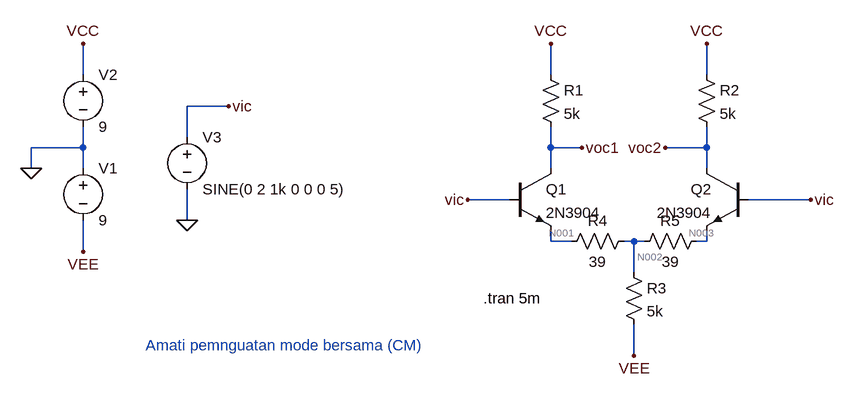
[diagram p0: schematic Perc-01-03-commonmode.asc]
Perc-01-03-commonmode.asc, the LTspice schematic file:
Version 4
SHEET 1 880 680
WIRE -320 -32 -320 -80
WIRE 400 -32 400 -80
WIRE 640 -32 640 -80
WIRE -96 16 -160 16
WIRE -160 64 -160 16
WIRE -320 80 -320 48
WIRE -320 80 -400 80
WIRE 400 80 400 48
WIRE 448 80 400 80
WIRE 640 80 640 48
WIRE 640 80 576 80
WIRE -400 112 -400 80
WIRE -320 112 -320 80
WIRE 400 112 400 80
WIRE 640 112 640 80
WIRE 336 160 272 160
WIRE 800 160 704 160
WIRE -160 192 -160 144
WIRE 400 224 400 208
WIRE 432 224 400 224
WIRE 528 224 512 224
WIRE 544 224 528 224
WIRE 640 224 640 208
WIRE 640 224 624 224
WIRE -320 240 -320 192
WIRE 528 272 528 224
WIRE 528 400 528 352
FLAG 400 -80 VCC
FLAG 640 -80 VCC
FLAG 528 400 VEE
FLAG 448 80 voc1
FLAG 576 80 voc2
FLAG -320 -80 VCC
FLAG -320 240 VEE
FLAG -400 112 0
FLAG -160 192 0
FLAG -96 16 vic
FLAG 272 160 vic
FLAG 800 160 vic
SYMBOL npn 336 112 R0
SYMATTR InstName Q1
SYMATTR Value 2N3904
SYMBOL npn 704 112 M0
SYMATTR InstName Q2
SYMATTR Value 2N3904
SYMBOL res 384 -48 R0
SYMATTR InstName R1
SYMATTR Value 5k
SYMBOL res 624 -48 R0
SYMATTR InstName R2
SYMATTR Value 5k
SYMBOL res 512 256 R0
SYMATTR InstName R3
SYMATTR Value 5k
SYMBOL voltage -320 96 R0
WINDOW 123 0 0 Left 0
WINDOW 39 0 0 Left 0
SYMATTR InstName V1
SYMATTR Value 9
SYMBOL voltage -320 -48 R0
WINDOW 123 0 0 Left 0
WINDOW 39 0 0 Left 0
SYMATTR InstName V2
SYMATTR Value 9
SYMBOL voltage -160 48 R0
WINDOW 123 0 0 Left 0
WINDOW 39 0 0 Left 0
SYMATTR InstName V3
SYMATTR Value SINE(0 2 1k 0 0 0 5)
SYMBOL res 528 208 R90
WINDOW 0 0 56 VBottom 2
WINDOW 3 32 56 VTop 2
SYMATTR InstName R4
SYMATTR Value 39
SYMBOL res 640 208 R90
WINDOW 0 0 56 VBottom 2
WINDOW 3 32 56 VTop 2
SYMATTR InstName R5
SYMATTR Value 39
TEXT 296 312 Left 2 !.tran 5m
TEXT -224 384 Left 2 ;Amati pemnguatan mode bersama (CM)

The netlist it stands for:
* Perc-01-03-commonmode.asc
Q1 voc1 vic N001 0 2N3904
Q2 voc2 vic N003 0 2N3904
R1 VCC voc1 5k
R2 VCC voc2 5k
R3 N002 VEE 5k
V1 0 VEE 9
V2 VCC 0 9
V3 vic 0 SINE(0 2 1k 0 0 0 5)
R4 N002 N001 39
R5 N003 N002 39
.model NPN NPN
.model PNP PNP
.lib standard.bjt
.tran 5m
* Amati pemnguatan mode bersama (CM)
.backanno
.end

* Results of the author's LTspice run, read from the files saved beside the schematic
* Operating Point, zero values left out:
*   V(voc1) = 4.854 V
*   V(n001) = -649.2 mV
*   V(voc2) = 4.854 V
*   V(n003) = -649.2 mV
*   V(vcc) = 9 V
*   V(n002) = -681.7 mV
*   V(vee) = -9 V
*   Ic(Q2) = 829.2 µA
*   Ib(Q2) = 2.641 µA
*   Ie(Q2) = -831.8 µA
*   Ic(Q1) = 829.2 µA
*   Ib(Q1) = 2.641 µA
*   Ie(Q1) = -831.8 µA
*   I(R5) = 831.8 µA
*   I(R4) = -831.8 µA
*   I(R3) = 1.664 mA
*   I(R2) = 829.2 µA
*   I(R1) = 829.2 µA
*   I(V3) = -5.282 µA
*   I(V2) = -1.658 mA
*   I(V1) = -1.664 mA
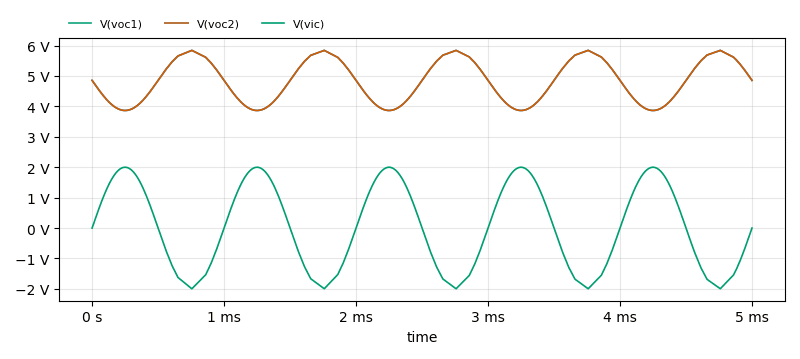
[diagram p1: Transient Analysis of Perc-01-03-commonmode.asc, plotted from the saved traces]
* Transient Analysis, 1 run:
*   V(voc1): min 3.865 V, max 5.841 V, average 4.847 V, rms 4.896 V, last 4.854 V
*   V(voc2): min 3.865 V, max 5.841 V, average 4.847 V, rms 4.896 V, last 4.854 V
*   V(vic): min -1.996 V, max 2 V, average 14.13 mV, rms 1.4 V, last 0 V